# EAGLE board fc (EAGLE 5.10)
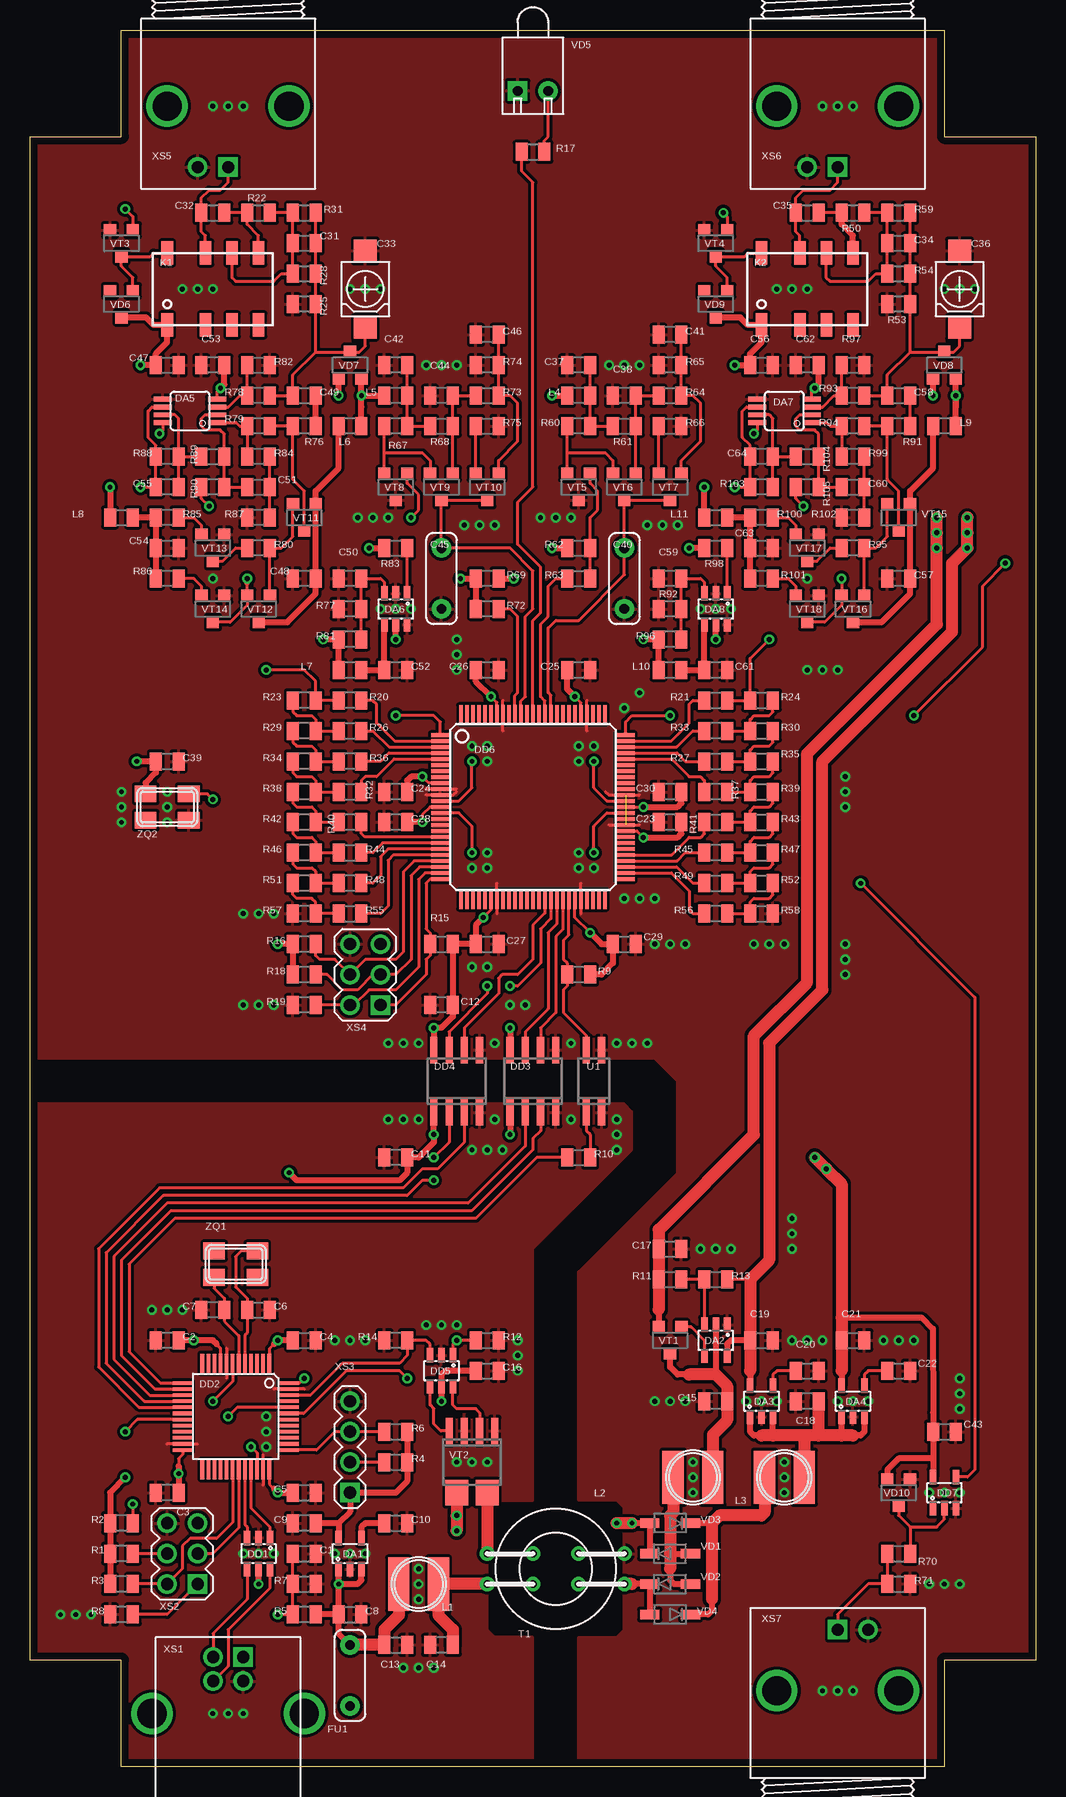
[diagram p4: board, top side]
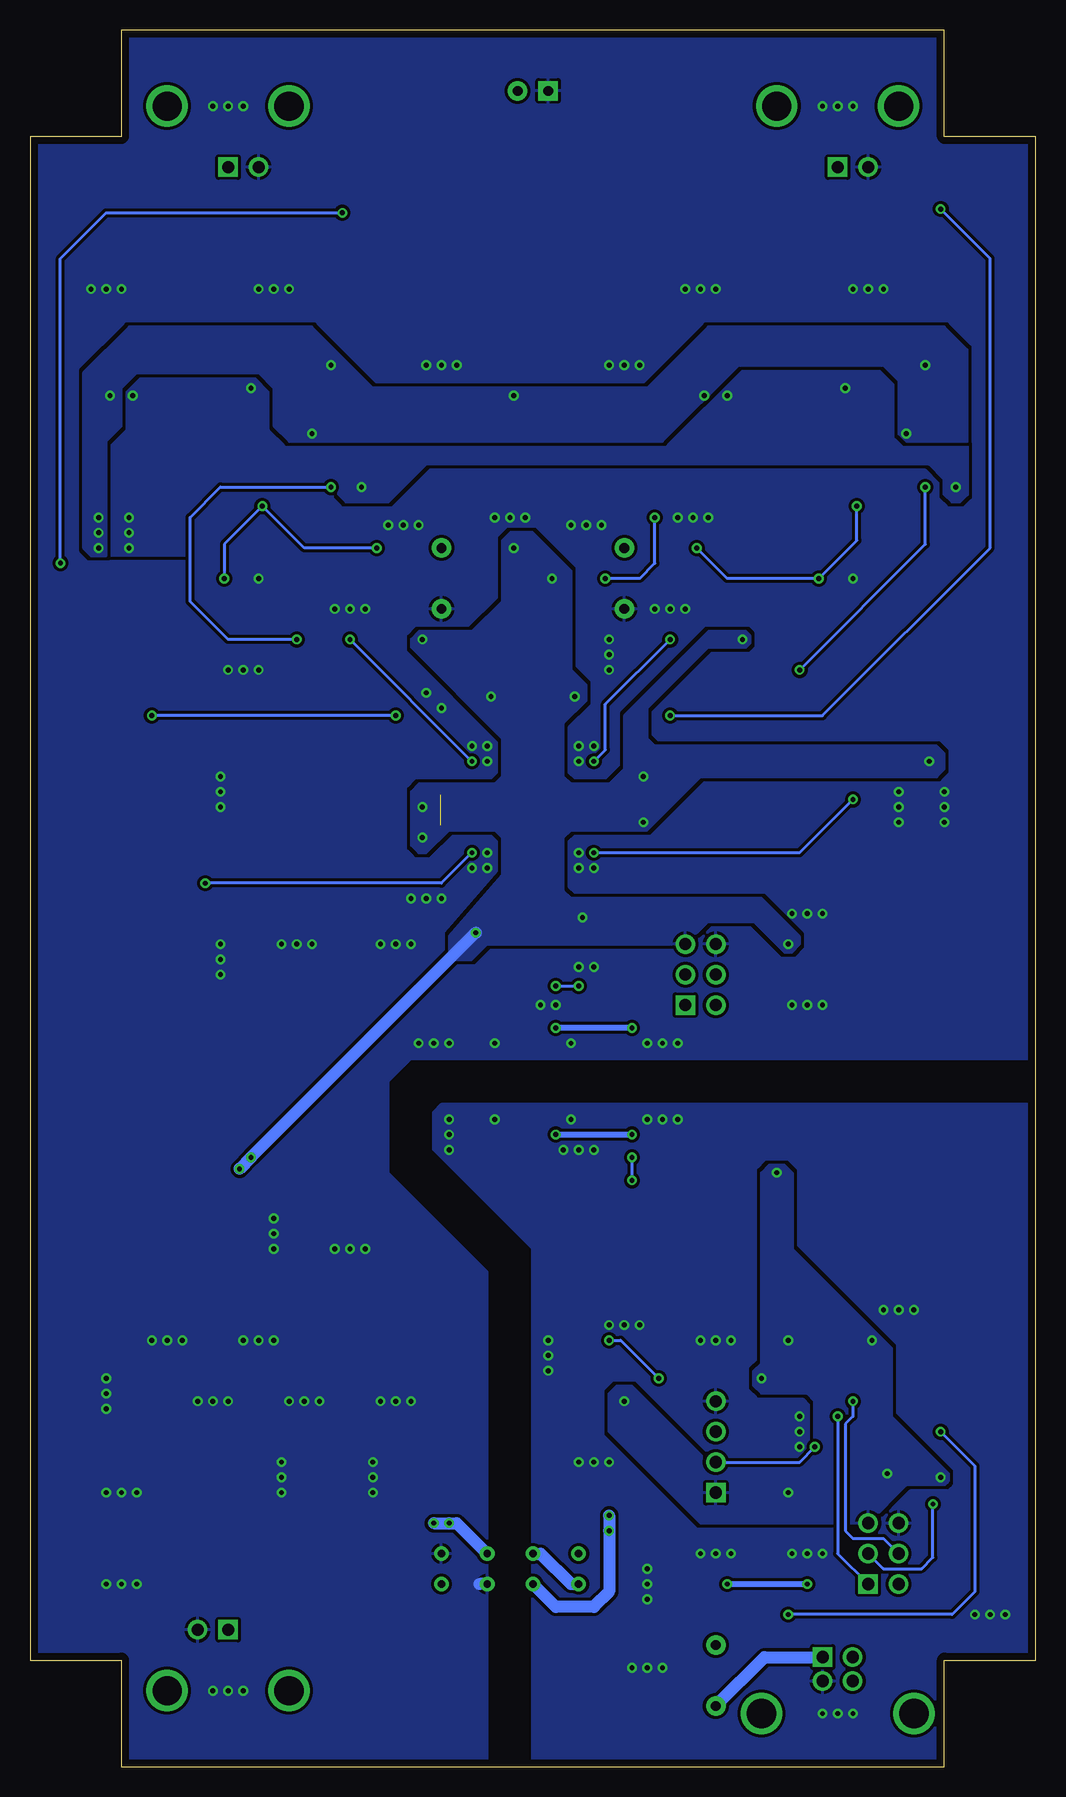
[diagram p5: board, bottom side, seen from below]

Size 83.82 x 144.78 mm. Coordinates in mm from the lower left corner, seen from the top.
Outline: 83.82,8.89 76.2,8.89 76.2,0 7.62,0 7.62,8.89 0,8.89 0,135.89 7.62,135.89 7.62,144.78 76.2,144.78 76.2,135.89 83.82,135.89 83.82,8.89
Copper layers (1*16): Top 0.035mm / dielectric 1.5mm / Bottom 0.035mm
Design rules "kovar *": minimum track width 10mil, minimum drill 16mil, track to track 6mil, track to pad 6mil, pad to pad 6mil, via to via 6mil, smd to smd 6mil, copper to edge 25mil, drill to drill 25mil, minimum pad ring 10mil, minimum via ring 8mil, stop-mask expansion 4mil, vias tented up to drill 32mil, thermal gap 10mil

## Footprints (pad centres in the part's own frame; a part is rotated, then mirrored left to right if it is on the bottom)
GENERIC/0805 = smd 1 x 1.5: 1 -0.95,0; 2 0.95,0
CAPACITOR/TRIM/TZBX4 = smd 1.905 x 1.905: 1 -3.175,0; 2 3.175,0
CAPACITOR/3 = drill 0.813 pad 1.626 round: 1 -2.54,0; 2 2.54,0
GENERIC/SOT23-5 = smd 0.55 x 1.2: 1 -0.95,-1.3; 2 0,-1.3; 3 0.95,-1.3; 4 0.95,1.3; 5 -0.95,1.3
MSOP08 = smd 0.4 x 1.5: 1 -0.976,-2.263; 2 -0.326,-2.263; 3 0.324,-2.263; 4 0.974,-2.263; 5 0.974,2.262; 6 0.324,2.262; 7 -0.326,2.262; 8 -0.976,2.262
GENERIC/SOT23-6 = smd 0.55 x 1.2: 1 -0.95,-1.3; 2 0,-1.3; 3 0.95,-1.3; 4 0.95,1.3; 5 0,1.3; 6 -0.95,1.3
LQFP48 = smd 1.6 x 0.3: 1 -4.431,2.794; 2 -4.431,2.286; 3 -4.431,1.778; 4 -4.431,1.27; 5 -4.431,0.762; 6 -4.431,0.254; 7 -4.431,-0.254; 8 -4.431,-0.762; 9 -4.431,-1.27; 10 -4.431,-1.778; 11 -4.431,-2.286; 12 -4.431,-2.794; 25 4.431,-2.794; 26 4.431,-2.286; 27 4.431,-1.778; 28 4.431,-1.27; 29 4.431,-0.762; 30 4.431,-0.254; 31 4.431,0.254; 32 4.431,0.762; 33 4.431,1.27; 34 4.431,1.778; 35 4.431,2.286; 36 4.431,2.794 | smd 0.3 x 1.6: 13 -2.794,-4.431; 14 -2.286,-4.431; 15 -1.778,-4.431; 16 -1.27,-4.431; 17 -0.762,-4.431; 18 -0.254,-4.431; 19 0.254,-4.431; 20 0.762,-4.431; 21 1.27,-4.431; 22 1.778,-4.431; 23 2.286,-4.431; 24 2.794,-4.431; 37 2.794,4.431; 38 2.286,4.431; 39 1.778,4.431; 40 1.27,4.431; 41 0.762,4.431; 42 0.254,4.431; 43 -0.254,4.431; 44 -0.762,4.431; 45 -1.27,4.431; 46 -1.778,4.431; 47 -2.286,4.431; 48 -2.794,4.431
SO08 = smd 0.6 x 2.2: 1 -1.905,-2.6; 2 -0.635,-2.6; 3 0.635,-2.6; 4 1.905,-2.6; 5 1.905,2.6; 6 0.635,2.6; 7 -0.635,2.6; 8 -1.905,2.6
LQFP100 = smd 1.524 x 0.305: 1 -7.72,6; 2 -7.72,5.5; 3 -7.72,5; 4 -7.72,4.5; 5 -7.72,4; 6 -7.72,3.5; 7 -7.72,3; 8 -7.72,2.5; 9 -7.72,2; 10 -7.72,1.5; 11 -7.72,1; 12 -7.72,0.5; 13 -7.72,0; 14 -7.72,-0.5; 15 -7.72,-1; 16 -7.72,-1.5; 17 -7.72,-2; 18 -7.72,-2.5; 19 -7.72,-3; 20 -7.72,-3.5; 21 -7.72,-4; 22 -7.72,-4.5; 23 -7.72,-5; 24 -7.72,-5.5; 25 -7.72,-6; 51 7.72,-6; 52 7.72,-5.5; 53 7.72,-5; 54 7.72,-4.5; 55 7.72,-4; 56 7.72,-3.5; 57 7.72,-3; 58 7.72,-2.5; 59 7.72,-2; 60 7.72,-1.5; 61 7.72,-1; 62 7.72,-0.5; 63 7.72,0; 64 7.72,0.5; 65 7.72,1; 66 7.72,1.5; 67 7.72,2; 68 7.72,2.5; 69 7.72,3; 70 7.72,3.5; 71 7.72,4; 72 7.72,4.5; 73 7.72,5; 74 7.72,5.5; 75 7.72,6 | smd 0.305 x 1.524: 26 -6,-7.72; 27 -5.5,-7.72; 28 -5,-7.72; 29 -4.5,-7.72; 30 -4,-7.72; 31 -3.5,-7.72; 32 -3,-7.72; 33 -2.5,-7.72; 34 -2,-7.72; 35 -1.5,-7.72; 36 -1,-7.72; 37 -0.5,-7.72; 38 0,-7.72; 39 0.5,-7.72; 40 1,-7.72; 41 1.5,-7.72; 42 2,-7.72; 43 2.5,-7.72; 44 3,-7.72; 45 3.5,-7.72; 46 4,-7.72; 47 4.5,-7.72; 48 5,-7.72; 49 5.5,-7.72; 50 6,-7.72; 76 6,7.72; 77 5.5,7.72; 78 5,7.72; 79 4.5,7.72; 80 4,7.72; 81 3.5,7.72; 82 3,7.72; 83 2.5,7.72; 84 2,7.72; 85 1.5,7.72; 86 1,7.72; 87 0.5,7.72; 88 0,7.72; 89 -0.5,7.72; 90 -1,7.72; 91 -1.5,7.72; 92 -2,7.72; 93 -2.5,7.72; 94 -3,7.72; 95 -3.5,7.72; 96 -4,7.72; 97 -4.5,7.72; 98 -5,7.72; 99 -5.5,7.72; 100 -6,7.72
RELAY/2/6/IM = smd 0.965 x 1.93: 1 -3.8,-3; 2 -0.6,-3; 3 1.6,-3; 4 3.8,-3; 5 3.8,3; 6 1.6,3; 7 -0.6,3; 8 -3.8,3
INDUCTOR/SDR0403 = smd 1.778 x 4.445: 1 -1.651,0; 2 1.651,0
TRANSFORMER/B64290L = drill 0.61 pad 1.219 round: 1 -5.715,1.27; 2 -1.905,1.27; 3 -5.715,-1.27; 4 -1.905,-1.27; 5 1.905,1.27; 6 5.715,1.27; 7 1.905,-1.27; 8 5.715,-1.27
SO04 = smd 0.6 x 2.2: 1 -0.635,-2.6; 2 0.635,-2.6; 3 0.635,2.6; 4 -0.635,2.6
GENERIC/SOD123 = smd 1.6 x 0.8: A 1.7,0; C -1.7,0
LED/3/R = drill 0.813 pad 1.626 round: A -1.27,0 | drill 0.813 pad 1.626 square: K 1.27,0
GENERIC/SOT23 = smd 1.016 x 1.016: 1 -0.95,-1.1; 2 0.95,-1.1; 3 0,1.1
SO08/6 = smd 0.6 x 2.2: 1 -1.905,-2.6; 2 -0.635,-2.6; 3 0.635,-2.6; 4 1.905,-2.6 | smd 1.905 x 2.159: 5,6 1.27,2.54; 7,8 -1.27,2.54
CONNECTOR/4/USBB-F = drill 1.016 pad 1.626 square: 1 1.25,4.075 | drill 1.016 pad 1.626 round: 2 -1.25,4.075; 3 -1.25,2.075; 4 1.25,2.075 | drill 2.438 pad 3.251 round: P$1 6.35,-0.635; P$2 -6.35,-0.635
CONNECTOR:6:PLD = drill 1.016 pad 1.626 square: 1 -2.54,-1.27 | drill 1.016 pad 1.626 round: 2 -2.54,1.27; 3 0,-1.27; 4 0,1.27; 5 2.54,-1.27; 6 2.54,1.27
CONNECTOR/4/PLS = drill 1.016 pad 1.626 square: 1 -3.81,0 | drill 1.016 pad 1.626 round: 2 -1.27,0; 3 1.27,0; 4 3.81,0
CONNECTOR/6/PLD = drill 1.016 pad 1.626 square: 1 -2.54,-1.27 | drill 1.016 pad 1.626 round: 2 -2.54,1.27; 3 0,-1.27; 4 0,1.27; 5 2.54,-1.27; 6 2.54,1.27
CONNECTOR/2/BNC = drill 1.016 pad 1.626 square: 1 0,-5.08 | drill 1.016 pad 1.626 round: 2 -2.54,-5.08 | drill 2.438 pad 3.251 round: P1 -5.08,0; P2 5.08,0
QUARTZ/KX-9A = smd 1.8 x 1.4: 1 -1.8,-1.1; 2 1.8,-1.1; 3 1.8,1.1; 4 -1.8,1.1

## Placement (x,y rotation side)
C1  u10  [GENERIC/0805]  22.86,17.78 0 top
C2  u10  [GENERIC/0805]  11.43,35.56 180 top
C3  u10  [GENERIC/0805]  11.43,22.86 180 top
C4  u10  [GENERIC/0805]  22.86,35.56 0 top
C5  u10  [GENERIC/0805]  22.86,22.86 0 top
C6  22p  [GENERIC/0805]  19.05,38.1 0 top
C7  22p  [GENERIC/0805]  15.24,38.1 180 top
C8  u10  [GENERIC/0805]  26.67,12.7 0 top
C9  10u  [GENERIC/0805]  22.86,20.32 180 top
C10  1n0  [GENERIC/0805]  30.48,20.32 0 top
C11  u10  [GENERIC/0805]  30.48,50.8 180 top
C12  u10  [GENERIC/0805]  34.29,63.5 180 top
C13  10u  [GENERIC/0805]  30.48,10.16 0 top
C14  10u  [GENERIC/0805]  34.29,10.16 180 top
C15  10u  [GENERIC/0805]  57.15,30.48 180 top
C16  u10  [GENERIC/0805]  38.1,33.02 0 top
C17  10u  [GENERIC/0805]  53.34,43.18 0 top
C18  10u  [GENERIC/0805]  64.77,30.48 180 top
C19  10u  [GENERIC/0805]  60.96,35.56 0 top
C20  1n0  [GENERIC/0805]  64.77,33.02 0 top
C21  10u  [GENERIC/0805]  68.58,35.56 0 top
C22  1n0  [GENERIC/0805]  72.39,33.02 0 top
C23  u10  [GENERIC/0805]  53.34,78.74 180 top
C24  u10  [GENERIC/0805]  30.48,81.28 180 top
C25  u10  [GENERIC/0805]  45.72,91.44 0 top
C26  u10  [GENERIC/0805]  38.1,91.44 0 top
C27  u10  [GENERIC/0805]  38.1,68.58 0 top
C28  u10  [GENERIC/0805]  30.48,78.74 180 top
C29  u10  [GENERIC/0805]  49.53,68.58 0 top
C30  u10  [GENERIC/0805]  53.34,81.28 180 top
C31  18pF*  [GENERIC/0805]  22.86,127 0 top
C32  68n  [GENERIC/0805]  15.24,129.54 0 top
C33  TZBX4  [CAPACITOR/TRIM/TZBX4]  27.94,123.19 90 top
C34  18pF*  [GENERIC/0805]  72.39,127 0 top
C35  68n  [GENERIC/0805]  64.77,129.54 0 top
C36  TZBX4  [CAPACITOR/TRIM/TZBX4]  77.47,123.19 90 top
C37  u10  [GENERIC/0805]  45.72,116.84 180 top
C38  u10  [GENERIC/0805]  49.53,114.3 180 top
C39  u10  [GENERIC/0805]  11.43,83.82 0 top
C40  1n0  [CAPACITOR/3]  49.53,99.06 270 top
C41  u10  [GENERIC/0805]  53.34,119.38 180 top
C42  u10  [GENERIC/0805]  30.48,116.84 180 top
C43  u10  [GENERIC/0805]  76.2,27.94 0 top
C44  u10  [GENERIC/0805]  34.29,114.3 180 top
C45  1n0  [CAPACITOR/3]  34.29,99.06 270 top
C46  u10  [GENERIC/0805]  38.1,119.38 180 top
C47  u10  [GENERIC/0805]  11.43,116.84 0 top
C48  u10  [GENERIC/0805]  22.86,99.06 180 top
C49  n47  [GENERIC/0805]  22.86,114.3 0 top
C50  u10  [GENERIC/0805]  26.67,99.06 180 top
C51  47n  [GENERIC/0805]  19.05,106.68 0 top
C52  u10  [GENERIC/0805]  30.48,91.44 0 top
C53  u10  [GENERIC/0805]  15.24,116.84 180 top
C54  u10  [GENERIC/0805]  11.43,101.6 0 top
C55  1n0  [GENERIC/0805]  11.43,106.68 180 top
C56  u10  [GENERIC/0805]  60.96,116.84 0 top
C57  u10  [GENERIC/0805]  72.39,99.06 180 top
C58  n47  [GENERIC/0805]  72.39,114.3 0 top
C59  u10  [GENERIC/0805]  53.34,99.06 180 top
C60  47n  [GENERIC/0805]  68.58,106.68 0 top
C61  u10  [GENERIC/0805]  57.15,91.44 0 top
C62  u10  [GENERIC/0805]  64.77,116.84 180 top
C63  u10  [GENERIC/0805]  60.96,101.6 0 top
C64  1n0  [GENERIC/0805]  60.96,109.22 180 top
DA1  TPS76333DBVR  [GENERIC/SOT23-5]  26.67,17.78 0 top
DA2  LM321  [GENERIC/SOT23-5]  57.15,35.56 180 top
DA3  TPS76350DBVR  [GENERIC/SOT23-5]  60.96,30.48 0 top
DA4  TPS76333DBVR  [GENERIC/SOT23-5]  68.58,30.48 0 top
DA5  TLV272IDGK  [MSOP08]  13.33,113.03 90 top
DA6  TLV3501AIDBVR  [GENERIC/SOT23-6]  30.48,96.52 180 top
DA7  TLV272IDGK  [MSOP08]  62.86,113.03 90 top
DA8  TLV3501AIDBVR  [GENERIC/SOT23-6]  57.15,96.52 180 top
DD1  USBLC6-2SC6  [GENERIC/SOT23-6]  19.05,17.78 180 top
DD2  STM32F042C6T  [LQFP48]  17.14,29.21 270 top
DD3  ISO7420DR  [SO08]  41.91,57.15 0 top
DD4  ISO7421DR  [SO08]  35.56,57.15 0 top
DD5  74LVC2G17  [GENERIC/SOT23-6]  34.29,33.02 180 top
DD6  EPM240T100C5  [LQFP100]  41.91,80.01 0 top
DD7  74LVC1G17  [GENERIC/SOT23-5]  76.2,22.86 0 top
FU1  MF-R110  [CAPACITOR/3]  26.67,7.62 270 top
K1  IM23GR  [RELAY/2/6/IM]  15.24,123.19 0 top
K2  IM23GR  [RELAY/2/6/IM]  64.77,123.19 0 top
L1  SDR0403-220  [INDUCTOR/SDR0403]  32.38,15.24 0 top
L2  SDR0403-560  [INDUCTOR/SDR0403]  55.24,24.13 0 top
L3  SDR0403-560  [INDUCTOR/SDR0403]  62.86,24.13 0 top
L4  BLM21  [GENERIC/0805]  45.72,114.3 180 top
L5  BLM21  [GENERIC/0805]  30.48,114.3 180 top
L6  BLM21  [GENERIC/0805]  26.67,111.76 180 top
L7  BLM21  [GENERIC/0805]  26.67,91.44 0 top
L8  BLM21  [GENERIC/0805]  7.62,104.14 0 top
L9  BLM21  [GENERIC/0805]  76.2,111.76 180 top
L10  BLM21  [GENERIC/0805]  53.34,91.44 0 top
L11  BLM21  [GENERIC/0805]  57.15,104.14 0 top
R1  10K  [GENERIC/0805]  7.62,17.78 180 top
R2  10K  [GENERIC/0805]  7.62,20.32 180 top
R3  10K  [GENERIC/0805]  7.62,15.24 180 top
R4  10K  [GENERIC/0805]  30.48,25.4 0 top
R5  M10  [GENERIC/0805]  22.86,12.7 180 top
R6  10K  [GENERIC/0805]  30.48,27.94 0 top
R7  M10  [GENERIC/0805]  22.86,15.24 0 top
R8  10K  [GENERIC/0805]  7.62,12.7 180 top
R9  10K  [GENERIC/0805]  45.72,66.04 180 top
R10  2K0  [GENERIC/0805]  45.72,50.8 0 top
R11  10K  [GENERIC/0805]  53.34,40.64 0 top
R12  M10  [GENERIC/0805]  38.1,35.56 0 top
R13  20K  [GENERIC/0805]  57.15,40.64 0 top
R14  M10  [GENERIC/0805]  30.48,35.56 180 top
R15  10K  [GENERIC/0805]  34.29,68.58 0 top
R16  10K  [GENERIC/0805]  22.86,68.58 180 top
R17  2K0  [GENERIC/0805]  41.91,134.62 0 top
R18  10K  [GENERIC/0805]  22.86,66.04 180 top
R19  10K  [GENERIC/0805]  22.86,63.5 180 top
R20  20K0  [GENERIC/0805]  26.67,88.9 180 top
R21  20K0  [GENERIC/0805]  57.15,88.9 0 top
R22  1M0  [GENERIC/0805]  19.05,129.54 0 top
R23  10K0  [GENERIC/0805]  22.86,88.9 180 top
R24  10K0  [GENERIC/0805]  60.96,88.9 0 top
R25  1M0  [GENERIC/0805]  22.86,121.92 180 top
R26  20K0  [GENERIC/0805]  26.67,86.36 0 top
R27  20K0  [GENERIC/0805]  57.15,86.36 180 top
R28  1M0  [GENERIC/0805]  22.86,124.46 0 top
R29  10K0  [GENERIC/0805]  22.86,86.36 180 top
R30  10K0  [GENERIC/0805]  60.96,86.36 0 top
R31  1M0  [GENERIC/0805]  22.86,129.54 0 top
R32  20K0  [GENERIC/0805]  26.67,83.82 180 top
R33  20K0  [GENERIC/0805]  57.15,83.82 0 top
R34  10K0  [GENERIC/0805]  22.86,83.82 180 top
R35  10K0  [GENERIC/0805]  60.96,83.82 0 top
R36  20K0  [GENERIC/0805]  26.67,81.28 0 top
R37  20K0  [GENERIC/0805]  57.15,81.28 180 top
R38  10K0  [GENERIC/0805]  22.86,81.28 180 top
R39  10K0  [GENERIC/0805]  60.96,81.28 0 top
R40  20K0  [GENERIC/0805]  26.67,78.74 180 top
R41  20K0  [GENERIC/0805]  57.15,78.74 0 top
R42  10K0  [GENERIC/0805]  22.86,78.74 180 top
R43  10K0  [GENERIC/0805]  60.96,78.74 0 top
R44  20K0  [GENERIC/0805]  26.67,76.2 0 top
R45  20K0  [GENERIC/0805]  57.15,76.2 180 top
R46  10K0  [GENERIC/0805]  22.86,76.2 180 top
R47  10K0  [GENERIC/0805]  60.96,76.2 0 top
R48  20K0  [GENERIC/0805]  26.67,73.66 180 top
R49  20K0  [GENERIC/0805]  57.15,73.66 0 top
R50  1M0  [GENERIC/0805]  68.58,129.54 0 top
R51  10K0  [GENERIC/0805]  22.86,73.66 180 top
R52  10K0  [GENERIC/0805]  60.96,73.66 0 top
R53  1M0  [GENERIC/0805]  72.39,121.92 180 top
R54  1M0  [GENERIC/0805]  72.39,124.46 0 top
R55  20K0  [GENERIC/0805]  26.67,71.12 0 top
R56  20K0  [GENERIC/0805]  57.15,71.12 180 top
R57  20K0  [GENERIC/0805]  22.86,71.12 180 top
R58  20K0  [GENERIC/0805]  60.96,71.12 0 top
R59  1M0  [GENERIC/0805]  72.39,129.54 0 top
R60  K12  [GENERIC/0805]  45.72,111.76 180 top
R61  K56  [GENERIC/0805]  49.53,111.76 0 top
R62  82R  [GENERIC/0805]  45.72,101.6 0 top
R63  K36  [GENERIC/0805]  45.72,99.06 0 top
R64  K36  [GENERIC/0805]  53.34,114.3 0 top
R65  K47  [GENERIC/0805]  53.34,116.84 180 top
R66  10K  [GENERIC/0805]  53.34,111.76 0 top
R67  K12  [GENERIC/0805]  30.48,111.76 180 top
R68  K56  [GENERIC/0805]  34.29,111.76 0 top
R69  82R  [GENERIC/0805]  38.1,99.06 180 top
R70  51R  [GENERIC/0805]  72.39,17.78 0 top
R71  10K  [GENERIC/0805]  72.39,15.24 0 top
R72  K36  [GENERIC/0805]  38.1,96.52 180 top
R73  K36  [GENERIC/0805]  38.1,114.3 0 top
R74  K47  [GENERIC/0805]  38.1,116.84 180 top
R75  10K  [GENERIC/0805]  38.1,111.76 0 top
R76  51R  [GENERIC/0805]  22.86,111.76 180 top
R77  K75  [GENERIC/0805]  26.67,96.52 180 top
R78  M82  [GENERIC/0805]  19.05,114.3 180 top
R79  1M0  [GENERIC/0805]  19.05,111.76 180 top
R80  51R  [GENERIC/0805]  19.05,101.6 180 top
R81  K24  [GENERIC/0805]  26.67,93.98 180 top
R82  M18  [GENERIC/0805]  19.05,116.84 0 top
R83  51R  [GENERIC/0805]  30.48,101.6 0 top
R84  8K2  [GENERIC/0805]  19.05,109.22 180 top
R85  K43  [GENERIC/0805]  11.43,104.14 180 top
R86  K43  [GENERIC/0805]  11.43,99.06 180 top
R87  1K8  [GENERIC/0805]  19.05,104.14 180 top
R88  3K3  [GENERIC/0805]  11.43,109.22 180 top
R89  18K  [GENERIC/0805]  15.24,109.22 0 top
R90  82K  [GENERIC/0805]  15.24,106.68 180 top
R91  51R  [GENERIC/0805]  72.39,111.76 180 top
R92  K75  [GENERIC/0805]  53.34,96.52 180 top
R93  M82  [GENERIC/0805]  68.58,114.3 180 top
R94  1M0  [GENERIC/0805]  68.58,111.76 180 top
R95  51R  [GENERIC/0805]  68.58,101.6 180 top
R96  K24  [GENERIC/0805]  53.34,93.98 180 top
R97  M18  [GENERIC/0805]  68.58,116.84 0 top
R98  51R  [GENERIC/0805]  57.15,101.6 0 top
R99  8K2  [GENERIC/0805]  68.58,109.22 180 top
R100  K43  [GENERIC/0805]  60.96,104.14 180 top
R101  K43  [GENERIC/0805]  60.96,99.06 180 top
R102  1K8  [GENERIC/0805]  68.58,104.14 180 top
R103  3K3  [GENERIC/0805]  60.96,106.68 180 top
R104  18K  [GENERIC/0805]  64.77,109.22 0 top
R105  82K  [GENERIC/0805]  64.77,106.68 180 top
T1  B64290L087  [TRANSFORMER/B64290L]  43.81,16.51 0 top
U1  TLP291  [SO04]  46.99,57.15 0 top
VD1  MBR0520  [GENERIC/SOD123]  53.34,17.78 0 top
VD2  MBR0520  [GENERIC/SOD123]  53.34,15.24 0 top
VD3  MBR0520  [GENERIC/SOD123]  53.34,20.32 180 top
VD4  MBR0520  [GENERIC/SOD123]  53.34,12.7 180 top
VD5  L-934EW/1GD  [LED/3/R]  41.91,139.7 180 top
VD6  BAT54  [GENERIC/SOT23]  7.62,121.92 180 top
VD7  BAV199  [GENERIC/SOT23]  26.67,116.84 0 top
VD8  BAV199  [GENERIC/SOT23]  76.2,116.84 0 top
VD9  BAT54  [GENERIC/SOT23]  57.15,121.92 180 top
VD10  BAV199  [GENERIC/SOT23]  72.39,22.86 180 top
VT1  MMBT4403  [GENERIC/SOT23]  53.34,35.56 180 top
VT2  IRF7311  [SO08/6]  36.83,25.4 180 top
VT3  BCR108  [GENERIC/SOT23]  7.62,127 180 top
VT4  BCR108  [GENERIC/SOT23]  57.15,127 180 top
VT5  BFT93  [GENERIC/SOT23]  45.72,106.68 180 top
VT6  BFT93  [GENERIC/SOT23]  49.53,106.68 180 top
VT7  BFR93  [GENERIC/SOT23]  53.34,106.68 180 top
VT8  BFT93  [GENERIC/SOT23]  30.48,106.68 180 top
VT9  BFT93  [GENERIC/SOT23]  34.29,106.68 180 top
VT10  BFR93  [GENERIC/SOT23]  38.1,106.68 180 top
VT11  MMBFJ309  [GENERIC/SOT23]  22.86,104.14 180 top
VT12  BFR93  [GENERIC/SOT23]  19.05,96.52 180 top
VT13  BFR93  [GENERIC/SOT23]  15.24,101.6 180 top
VT14  BFR93  [GENERIC/SOT23]  15.24,96.52 180 top
VT15  MMBFJ309  [GENERIC/SOT23]  72.39,104.14 180 top
VT16  BFR93  [GENERIC/SOT23]  68.58,96.52 180 top
VT17  BFR93  [GENERIC/SOT23]  64.77,101.6 180 top
VT18  BFR93  [GENERIC/SOT23]  64.77,96.52 180 top
XS1  USBB-1J  [CONNECTOR/4/USBB-F]  16.51,5.08 0 top
XS2  PLD-6  [CONNECTOR:6:PLD]  12.7,17.78 90 top
XS3  PLS-4  [CONNECTOR/4/PLS]  26.67,26.67 90 top
XS4  PLD-6  [CONNECTOR/6/PLD]  27.94,66.04 90 top
XS5  BNC-JR  [CONNECTOR/2/BNC]  16.51,138.43 0 top
XS6  BNC-JR  [CONNECTOR/2/BNC]  67.31,138.43 0 top
XS7  BNC-JR  [CONNECTOR/2/BNC]  67.31,6.35 180 top
ZQ1  KX-9A 8.0MHz  [QUARTZ/KX-9A]  17.14,41.91 180 top
ZQ2  FOX924B-25.000  [QUARTZ/KX-9A]  11.43,80.01 0 top

## Tracks (layer width: path | path; a pad name or v marks a point on that pad's centre or on a via)
0V  (via drill 0.41 pad 0.81)
  Top 0.254: 13.97,26.92 DD2.23 11.43,26.92 | 19.43,23.49 DD2.35 19.43,26.04 | 22.86,31.5 DD2.47 20.32,31.5 | 16.38,34.92 DD2.8 16.38,32.38
  other vias: 38.73,53.98 45.08,53.98 48.89,53.98 32.38,53.98 5.08,12.7 3.81,12.7 2.54,12.7 12.7,38.1 11.43,38.1 10.16,38.1 25.4,35.56 26.67,35.56 27.94,35.56 35.56,25.4 36.83,25.4 38.1,25.4 32.38,16.51 32.38,15.24 32.38,13.97 31.11,8.25 32.38,8.25 33.65,8.25 31.11,53.98 29.84,53.98 48.89,52.7 48.89,51.44 38.1,51.44 36.83,51.44 39.37,51.44 17.78,17.78 19.05,17.78 20.32,17.78 25.4,17.78 26.67,17.78 27.94,17.78 16.51,4.45 15.24,4.45 17.78,4.45 19.68,29.21 19.68,27.94 19.68,26.67 40.64,33.02 40.64,34.29 40.64,35.56 34.29,36.83 35.56,36.83 33.02,36.83
  pour Bottom (isolate 0.254, rank 6): 0,8.89 7.62,8.89 7.62,0 41.91,0 41.91,43.18 50.16,51.44 50.16,54.61 49.53,55.25 0,55.25
  pour Top (isolate 0.254, rank 6): 0,8.89 7.62,8.89 7.62,0 41.91,0 41.91,10.8 38.73,10.8 38.1,11.43 38.1,21.59 38.73,22.23 41.91,22.23 41.91,43.18 50.16,51.44 50.16,54.61 49.53,55.25 0,55.25
0VA  (via drill 0.41 pad 0.81)  (1 unrouted)
  Top 0.254: 50.8,81.01 DD6.65 48.21,81.01 47.94,81.28 | 50.8,78.51 DD6.60 48.26,78.51 | 39.41,86.36 DD6.93 39.41,88.9 | 46.41,86.36 DD6.79 46.41,88.9 | 38.91,73.66 DD6.32 38.91,71.12 | 45.91,73.66 DD6.46 45.91,71.12 | 35.56,81.51 DD6.10 33.02,81.51 | 33.02,81.01 DD6.11 35.29,81.01 35.56,81.28
  Bottom 1.016: T1.7 46.35,15.24
  other vias: 38.73,60.33 45.08,60.33 48.89,60.33 32.38,60.33 55.24,25.4 55.24,24.13 55.24,22.86 62.86,25.4 62.86,24.13 62.86,22.86 59.69,30.48 60.96,30.48 62.23,30.48 67.31,30.48 68.58,30.48 69.85,30.48 71.12,35.56 72.39,35.56 63.5,35.56 64.77,35.56 66.04,35.56 73.66,35.56 55.88,43.18 57.15,43.18 58.42,43.18 54.61,30.48 53.34,30.48 52.07,30.48 77.47,29.84 77.47,31.12 77.47,32.38 50.16,60.33 51.43,60.33 31.11,60.33 29.84,60.33 40,63.5 41.27,63.5 20.32,63.5 19.05,63.5 17.78,63.5 20.32,71.12 19.05,71.12 17.78,71.12 7.62,80.01 7.62,81.28 7.62,78.74 38.1,74.93 36.83,74.93 38.1,76.2 49.53,72.39 50.8,72.39 52.07,72.39 52.07,68.58 53.34,68.58 54.61,68.58 49.53,88.27 50.8,89.53 35.56,91.44 35.56,92.71 35.56,93.98 36.19,103.5 37.46,103.5 38.73,103.5 51.43,103.5 52.7,103.5 53.97,103.5 42.54,104.14 43.81,104.14 45.08,104.14 29.84,104.14 28.57,104.14 27.3,104.14 33.02,116.84 34.29,116.84 35.56,116.84 48.26,116.84 49.53,116.84 50.8,116.84 64.77,123.19 63.5,123.19 62.23,123.19 15.24,123.19 13.97,123.19 12.7,123.19 29.21,123.19 27.94,123.19 26.67,123.19 77.47,123.19 76.2,123.19 78.74,123.19 15.24,99.06 29.21,96.52 30.48,96.52 31.75,96.52 55.88,96.52 57.15,96.52 58.42,96.52 64.77,99.06 38.1,83.82 38.1,85.09 36.83,85.09 45.72,76.2 45.72,74.93 46.99,74.93 46.99,85.09 45.72,85.09 45.72,83.82 38.1,66.67 36.83,66.67 11.43,81.28 11.43,80.01 11.43,78.74 67.31,91.44 64.77,91.44 66.04,91.44 67.94,82.55 67.94,81.28 67.94,80.01 62.86,68.58 61.59,68.58 60.32,68.58 67.94,67.31 67.94,68.58 67.94,66.04 63.5,43.18 63.5,44.45 63.5,45.72 74.93,15.24 76.2,15.24 77.47,15.24 74.93,22.86 76.2,22.86 77.47,22.86 15.24,138.43 16.51,138.43 17.78,138.43 66.04,138.43 67.31,138.43 68.58,138.43 66.04,6.35 67.31,6.35 68.58,6.35
  pour Top (isolate 0.254, rank 6): 0,135.89 7.62,135.89 7.62,144.78 76.2,144.78 76.2,135.89 83.82,135.89 83.82,8.89 76.2,8.89 76.2,0 45.72,0 45.72,10.8 48.89,10.8 49.53,11.43 49.53,21.59 48.89,22.23 45.72,22.23 45.72,41.28 53.97,49.53 53.97,57.15 52.07,59.05 0,59.05
  pour Bottom (isolate 0.254, rank 6): 7.62,144.78 76.2,144.78 76.2,135.89 83.82,135.89 83.82,8.89 76.2,8.89 76.2,0 45.72,0 45.72,41.28 53.97,49.53 53.97,57.15 52.07,59.05 0,59.05 0,135.89 7.62,135.89
CH1_CLK  (via drill 0.41 pad 0.81)
  Top 0.254: DD6.12 35.74,80.51 36.83,81.6 v36.83,83.82
  Top 0.508: v30.48,93.98 DA6.5
  Bottom 0.254: v30.48,93.98 35.88,88.58 35.88,84.77 v36.83,83.82
CH1_DAC  (via drill 0.41 pad 0.81)
  Top 0.254: R20.2 R23.1 23.81,90.49 22.86,91.44 v19.68,91.44 | DA5.6 10.17,113.35 9.84,113.03 9.84,110.81 10.48,110.17 R88.2 C55.2 v9.21,106.68
  Bottom 0.254: v19.68,91.44 9.21,101.92 v9.21,106.68
CH1_DAC0
  Top 0.254: R55.2 29.21,71.12 29.84,71.75 29.84,75.56 30.29,76.01 DD6.21
CH1_DAC1
  Top 0.254: DD6.20 29.84,76.51 29.21,75.88 29.21,74.3 28.57,73.66 R48.1
CH1_DAC2
  Top 0.254: DD6.19 29.38,77.01 28.57,76.2 R44.2
CH1_DAC3
  Top 0.254: DD6.18 27.9,77.51 27.62,77.79 R40.1
CH1_DAC4
  Top 0.254: R36.2 27.62,82.23 27.94,82.55 28.89,82.55 30.35,84.01 DD6.5
CH1_DAC5
  Top 0.254: DD6.4 29.9,84.51 29.21,83.82 R32.1
CH1_DAC6
  Top 0.254: R26.2 28.57,86.36 29.92,85.01 DD6.3
CH1_DAC7
  Top 0.254: DD6.2 30.38,85.51 28.89,87 28.89,88.58 28.57,88.9 R20.1
CH1_HPF  (via drill 0.41 pad 0.81)
  Top 0.254: DD6.1 34.19,87.09 33.65,87.63 v30.48,87.63 | VT3.1 8.57,129.22 v7.94,129.86
  Bottom 0.254: v30.48,87.63 17.78,87.63 3.81,101.6 3.81,125.73 v7.94,129.86
CH1_LNA
  Top 0.254: R31.2 C31.2 R28.2 R25.1 23.81,117.94 | R78.1 C49.1 21.91,116.04 23.81,117.94 | 23.81,117.94 VD7.3 27.45,117.94 27.94,118.43 C33.1
CH2_CLK  (via drill 0.41 pad 0.81)
  Top 0.254: DD6.64 48.08,80.51 46.99,81.6 v46.99,83.82
  Top 0.508: v57.15,93.98 DA8.5
  Bottom 0.254: v46.99,83.82 v57.15,93.98
CH2_DAC  (via drill 0.41 pad 0.81)
  Top 0.254: R21.2 R24.1 60.01,92.39 v61.59,93.98 | DA7.6 59.7,113.35 59.37,113.03 59.37,110.81 60.01,110.17 C64.2 R103.2 v58.74,106.68
  Bottom 0.254: v61.59,93.98 67.31,93.98 70.48,97.16 70.48,104.14 67.94,106.68 v58.74,106.68
CH2_DAC0
  Top 0.254: DD6.52 53.44,74.51 54.93,73.03 54.93,71.44 55.24,71.12 R56.2
CH2_DAC1
  Top 0.254: DD6.53 53.89,75.01 55.24,73.66 R49.1
CH2_DAC2
  Top 0.254: DD6.54 53.92,75.51 54.61,76.2 R45.2
CH2_DAC3
  Top 0.254: DD6.55 53.47,76.01 54.93,77.47 55.88,77.47 56.2,77.79 R41.1
CH2_DAC4
  Top 0.254: R37.2 56.2,82.23 55.88,82.55 54.93,82.55 53.47,84.01 DD6.71
CH2_DAC5
  Top 0.254: R33.1 54.61,83.82 53.92,84.51 DD6.72
CH2_DAC6
  Top 0.254: DD6.73 53.89,85.01 55.24,86.36 R27.2
CH2_DAC7
  Top 0.254: DD6.74 53.44,85.51 54.93,87 54.93,88.58 55.24,88.9 R21.1
CH2_HPF  (via drill 0.41 pad 0.81)
  Top 0.254: DD6.75 49.63,87.09 50.16,87.63 v53.34,87.63 | VT4.1 58.1,129.22 v57.78,129.54 | v73.66,87.63 79.38,93.34 79.38,98.42 v81.28,100.33
  Bottom 0.254: v53.34,87.63 v73.66,87.63 | v81.28,100.33 81.28,125.73 77.47,129.54 v57.78,129.54
CH2_LNA
  Top 0.254: R59.2 C34.2 R54.2 R53.1 73.34,117.94 | R93.1 C58.1 | 73.34,117.94 VD8.3 76.98,117.94 77.47,118.43 C36.1 | C58.1 71.44,116.04 73.34,117.94
  Top 0.508: C58.1
EXT_CLK  (via drill 0.41 pad 0.81)
  Top 0.254: DD6.62 48.08,79.51 46.99,78.42 v46.99,76.2 | DD7.4 78.13,24.16 78.74,24.77 78.74,64.14 v69.22,73.66
  Bottom 0.254: v69.22,73.66 49.53,73.66 v46.99,76.2
MCU_MISO  (via drill 0.41 pad 0.81)
  Top 0.254: DD2.16 9.52,30.48 6.35,33.66 6.35,42.86 11.11,47.62 31.43,47.62 32.7,48.89 v33.65,48.89 | v33.65,50.8 34.92,52.07 DD4.2
  Bottom 0.254: v33.65,50.8 v33.65,48.89
MCU_MOSI
  Top 0.254: DD2.17 9.08,29.97 5.71,33.34 5.71,43.18 10.79,48.26 31.11,48.26 32.7,49.85 33.97,49.85 36.19,52.07 DD4.3
MCU_NSS
  Top 0.254: DD2.14 10.41,31.5 7.62,34.29 7.62,42.23 11.75,46.36 36.83,46.36 41.91,51.44 41.91,52.39 42.54,53.02 DD3.3
MCU_RST
  Top 0.254: DD2.13 10.86,32 8.25,34.61 8.25,41.91 12.06,45.72 37.15,45.72 42.23,50.8 R10.1
MCU_SCK
  Top 0.254: DD2.15 9.97,30.99 6.98,33.97 6.98,42.55 11.43,46.99 36.51,46.99 41.27,51.75 DD3.2
N$1
  Top 0.254: R26.1 R29.1 23.81,87.31 23.49,87.63 22.22,87.63 21.91,87.94 R23.2
N$2
  Top 0.254: R82.1 R78.2 17.46,114.3 16.52,113.35 DA5.3
N$3
  Top 0.254: DA5.2 14.6,112.7 14.29,112.4 14.29,111.76 14.6,111.44 15.87,111.44 16.19,111.13 R89.2 R90.1 C51.1
N$4
  Top 0.254: DA7.3 66.05,113.35 66.99,114.3 R93.2 R97.1
N$5
  Top 0.254: R36.1 R38.1 23.81,82.23 23.49,82.55 22.22,82.55 21.91,82.86 R34.2
N$6
  Top 0.254: R32.2 R34.1 23.81,84.78 23.49,85.09 22.22,85.09 21.91,85.41 R29.2
N$7
  Top 0.254: DA6.1 R83.2
N$8
  Top 0.254: R79.1 R76.2 21.91,107.31 22.86,106.36 VT11.3
N$9
  Top 0.254: R44.1 R46.1 23.81,77.16 23.49,77.47 22.22,77.47 21.91,77.78 R42.2
N$10
  Top 0.254: R40.2 R42.1 23.81,79.69 23.49,80.01 22.22,80.01 21.91,80.33 R38.2
N$11
  Top 0.508: R76.1 C49.2
N$12
  Top 0.254: R84.1 C51.2 R87.1
N$13
  Top 0.254: R55.1 R57.1 23.81,72.08 23.49,72.39 22.22,72.39 21.91,72.7 R51.2
N$14
  Top 0.254: R48.2 R51.1 23.81,74.61 23.49,74.93 22.22,74.93 21.91,75.25 R46.2
N$15
  Top 0.254: R84.2 R79.2 17.46,111.76 17.17,112.05 DA5.1
N$16
  Top 0.254: C55.1 R88.1 | R88.1 R89.1 | DA5.7 12.07,112.7 12.38,112.4 R88.1
N$17
  Top 0.254: R27.1 R30.1 60.01,87.31 60.32,87.63 61.59,87.63 61.91,87.94 R24.2
N$18
  Top 0.254: VT13.3 16.04,100.5 17.14,101.6 R80.2
N$19
  Top 0.254: VT13.2 14.29,103.5 13.65,104.14 R85.1
N$20
  Top 0.254: VT14.2 14.29,98.42 13.65,99.06 R86.1
N$21
  Top 0.254: R37.1 R39.1 60.01,82.23 60.32,82.55 61.59,82.55 61.91,82.86 R35.2
N$22
  Top 0.254: R33.2 R35.1 60.01,84.78 60.32,85.09 61.59,85.09 61.91,85.41 R30.2
N$23
  Top 0.254: VT11.2 21.91,102.56 20.95,101.6 R80.1 VT12.1
N$24  (via drill 0.41 pad 0.81)
  Top 0.254: VT14.3 16.68,95.42 18.1,96.84 VT12.2 18.1,98.74 | R90.2 14.29,105.73 v14.92,105.09
  Top 0.508: 18.1,98.74 v18.1,99.06 | v28.26,101.6 R83.1
  Bottom 0.254: v28.26,101.6 25.72,99.06 v18.1,99.06 14.92,102.23 v14.92,105.09
N$25
  Top 0.254: R45.1 R47.1 60.01,77.16 60.32,77.47 61.59,77.47 61.91,77.78 R43.2
N$26
  Top 0.254: R41.2 R43.1 60.01,79.69 60.32,80.01 61.59,80.01 61.91,80.33 R39.2
N$27
  Top 0.508: R86.2 C54.1 R85.2 L8.2
N$28
  Top 0.508: VT12.3 21.44,95.42 23.81,97.79 C48.1 VT11.1 23.81,106.36 25.72,108.27 L6.2
N$29
  Top 0.254: R56.1 R58.1 60.01,72.08 60.32,72.39 61.59,72.39 61.91,72.7 R52.2
N$30
  Top 0.254: R49.2 R52.1 60.01,74.61 60.32,74.93 61.59,74.93 61.91,75.25 R47.2
N$31
  Top 0.254: R81.1 R77.1 C50.1 29.21,99.06 29.53,98.74 DA6.3
N$32
  Top 0.254: DA7.2 64.13,112.7 63.82,112.4 63.82,111.76 64.13,111.44 65.41,111.44 65.72,111.13 R104.2 R105.1 C60.1
N$33
  Top 0.254: R94.1 R91.2 71.44,107.31 72.39,106.36 VT15.3
N$34
  Top 0.254: R91.1 C58.2
N$35
  Top 0.508: L7.2 C52.1 DA6.4
N$36
  Top 0.254: VT17.3 65.57,100.5 66.67,101.6 R95.2
N$37
  Top 0.254: R100.1 63.18,104.14 63.82,103.5 VT17.2
  Top 0.508: VT17.2
N$38
  Top 0.254: R101.1 63.18,99.06 63.82,98.42 VT18.2
  Top 0.508: VT18.2
N$39
  Top 0.254: VT16.1 R95.1 70.48,101.6 71.44,102.56 VT15.2
N$40  (via drill 0.41 pad 0.81)
  Top 0.254: v64.45,105.09 63.82,105.73 R105.2 | VT18.3 66.21,95.42 67.63,96.84 VT16.2 67.63,98.74 v67.63,99.06
  Top 0.508: R98.1 v54.93,101.6
  Bottom 0.254: v67.63,99.06 67.63,101.92 v64.45,105.09 60.96,101.6 v54.93,101.6
N$41
  Top 0.508: L11.2 R100.2 C63.1 R101.2
N$42
  Top 0.508: VT16.3 70.97,95.42 73.34,97.79 C57.1 VT15.1 73.34,106.36 75.25,108.27 L9.2
N$43
  Top 0.508: DA8.4 C61.1 L10.2
N$44
  Top 0.254: R96.1 R92.1 C59.1 55.88,99.06 56.2,98.74 DA8.3
N$45
  Top 0.254: R99.1 C60.2 R102.1
N$46
  Top 0.254: R99.2 R94.2 66.67,111.76 66.38,112.05 DA7.1
N$47
  Top 0.254: DA8.1 R98.2
N$48
  Top 0.254: DA7.7 61.6,112.7 61.91,112.4 C64.1 | C64.1 R104.1 | R103.1 C64.1
N$49
  Top 0.254: 64.13,126.22 64.13,127.63 63.82,127.95 C35.1 63.82,130.81 64.45,131.44 66.67,131.44 67.31,132.08 XS6.1
  Top 0.508: K2.7 64.13,126.22
N$50
  Top 0.254: 14.6,126.22 14.6,127.63 14.29,127.95 C32.1 14.29,130.81 14.92,131.44 15.87,131.44 16.51,132.08 XS5.1
  Top 0.508: K1.7 14.6,126.22
N$51
  Top 0.254: C32.2 R22.1 18.1,128.59 19.04,127.65 K1.5
N$52
  Top 0.254: R22.2 R31.1 C31.1 R28.1 20.95,124.46 20.32,123.83 17.14,123.83 16.84,124.13 K1.6
N$53
  Top 0.254: R50.1 C35.2
  Top 0.508: K2.5 68.57,127.65 67.63,128.59 R50.1
N$54
  Top 0.254: VT5.2 44.77,109.54 | 44.77,109.54 R60.2 | VT6.2 48.58,108.9 47.94,109.54 44.77,109.54
N$55
  Top 0.254: VD6.1 8.57,124.15 7.62,125.09 VT3.3 10.01,125.9 10.3,126.19 K1.8
N$56
  Top 0.254: VD9.1 58.1,124.15 57.15,125.09 VT4.3 59.54,125.9 59.83,126.19 K2.8
N$57
  Top 0.254: XS7.1 67.31,12.7 69.85,15.24 R71.1 R70.1
N$58
  Top 0.254: VT7.2 R66.1
N$59
  Top 0.254: VT8.2 29.53,109.54 | 29.53,109.54 R67.2 | VT9.2 33.34,108.9 32.7,109.54 29.53,109.54
N$60
  Top 0.254: C41.1 R65.1 R64.2 55.24,114.3 55.88,113.66 55.88,110.49 54.29,108.9 VT7.1
N$61
  Top 0.254: VT6.1 R61.2 C38.1 R64.1
N$62
  Top 0.254: R50.2 R59.1 C34.1 R54.1 70.48,124.46 69.85,123.83 66.67,123.83 66.37,124.13 K2.6
N$63
  Top 0.254: VT5.1 46.67,107 47.31,106.36 47.31,104.78 46.67,104.14 R62.2 R63.2
N$64
  Top 0.254: R17.2 42.86,135.57 43.18,135.89 VD5.A
N$65
  Top 0.254: C37.1 L4.1 R60.1 R61.1
N$66
  Top 0.254: 73.34,20.01 R70.2 | 73.34,20.01 72.39,20.95 VD10.3 | DD7.2 76.2,20.64 75.56,20 73.34,20 73.34,20.01
N$67
  Top 0.254: VT10.2 R75.1
N$68
  Top 0.254: C46.1 R74.1 R73.2 40,114.3 40.64,113.66 40.64,110.49 39.05,108.9 VT10.1
N$69
  Top 0.254: R73.1 C44.1 R68.2 VT9.1
N$70  (via drill 0.41 pad 0.81)
  Top 0.254: VT8.1 31.43,107 32.38,106.05 32.38,104.78 v31.75,104.14
  Top 0.508: v35.88,99.06 R69.2 R72.2
  Bottom 0.254: v31.75,104.14 31.75,100.33 33.02,99.06 v35.88,99.06
N$71
  Top 0.508: C14.1
  Top 1.016: C14.1 35.24,11.43 34.04,12.64 L1.2 T1.3
  Bottom 1.016: T1.3 38.73,15.24 41.27,17.78 T1.2
N$72
  Top 0.254: C42.1 L5.1 R67.1 R68.1
N$73
  Top 0.254: XS1.2 15.26,11.13 18.1,13.97 DD1.4
N$74
  Top 0.254: XS1.3 16.51,8.41 16.51,11.43 20,14.92 DD1.6
N$75
  Bottom 1.016: XS1.1 22.59,9.16 FU1.2
N$76
  Top 0.254: R10.2 46.67,52.71 46.35,53.02 U1.1
N$77  (via drill 0.41 pad 0.81)
  Top 1.016: v35.56,19.69 v35.56,20.95 VT2.5,6
  Bottom 1.016: T1.4 40,13.34 36.83,13.34 35.56,14.61 v35.56,19.69 v35.56,20.95
N$78
  Top 0.254: DA2.3 R13.1 R11.2
N$79
  Top 0.508: DA1.4 27.62,20 27.94,20.32 C10.1
N$80
  Top 1.016: VT2.7,8 T1.1
N$81
  Top 0.254: VT2.4 34.23,28 33.65,28.58 33.65,29.84 33.34,30.16 DD5.4
N$82
  Top 0.254: DD5.6 35.24,30.16 35.56,29.84 37.15,29.84 37.46,29.53 VT2.2
N$83
  Top 0.508: VD4.A VD2.C 50.16,15.24
  Top 1.016: 50.16,15.24 T1.8
N$84  (via drill 0.41 pad 0.81)
  Top 0.508: v50.16,20.32 VD3.A VD1.C
  Top 1.016: v50.16,20.32 v48.89,20.32
  Bottom 1.016: T1.5 48.26,20.32 v48.89,20.32 v50.16,20.32
N$85
  Top 0.508: VD4.C 56.52,12.7 56.83,13.02 56.83,13.97 | 56.83,20.32 VD3.C
  Top 1.016: 56.83,13.97 56.83,20.32 57.47,20.95 60.96,20.95 61.21,21.21 L3.1
N$86
  Top 0.508: VD2.A 53.66,15.24 53.34,15.56 53.34,16.51 | 53.34,17.78 VD1.A
  Top 1.016: 53.34,16.51 53.34,17.78 53.34,20.95 53.59,21.21 L2.1
N$87
  Top 0.254: VT1.1 55.1,36.66 56.2,35.56 DA2.4
N$88
  Top 0.508: DA3.1 60.01,27.94 60.32,27.62 60.96,27.62 | DA4.3 69.53,27.94 69.22,27.62 68.58,27.62 | DA4.1 67.63,27.62 | DA3.3 61.91,27.62
  Top 1.016: C18.1 65.72,27.62 | 68.58,27.62 67.63,27.62 65.72,27.62 | 65.72,27.62 64.45,27.62 | 64.45,27.62 61.91,27.62 60.96,27.62 | 64.45,27.62 64.52,27.56 L3.2
N$89
  Top 0.254: DA3.4 61.91,32.7 62.23,33.02 C20.1
N$90
  Top 0.254: DA4.4 69.53,32.7 69.85,33.02 C22.1
N$91
  Top 0.508: VT1.3 53.34,33.34 53.97,32.7 54.93,32.7 | DA2.2 57.15,32.7
  Top 1.016: 54.93,32.7 57.15,32.7 58.1,31.75 C15.1 58.1,28.89 56.9,27.69 L2.2
PLD_LED
  Top 0.254: DD6.88 41.91,95.57 42.54,96.2 42.54,100.01 40.64,101.92 40.64,105.41 41.91,106.68 41.91,132.08 40.96,133.03 R17.1
PLD_MISO  (via drill 0.41 pad 0.81)
  Top 0.254: DD6.41 43.41,70.72 42.54,69.85 42.54,66.99 41.27,65.72 40.64,65.09 v40,65.09 | DD4.7 34.92,61.28 38.1,64.45 v38.1,65.09
  Bottom 0.254: v40,65.09 v38.1,65.09
PLD_MOSI
  Top 0.254: DD6.40 42.91,71.17 41.91,70.17 41.91,67.31 40.64,66.04 39.37,66.04 39.05,65.72 39.05,64.45 36.19,61.59 DD4.6
PLD_NSS
  Top 0.254: DD6.43 44.41,69.81 43.81,69.22 43.81,62.87 42.54,61.59 DD3.6
PLD_RST
  Top 0.254: DD6.44 44.91,69.36 44.45,68.9 44.45,67.31 44.77,66.99 R9.2 44.77,65.09 44.45,64.77 44.45,62.87 46.35,60.96 U1.4
PLD_SCK
  Top 0.254: DD6.42 43.91,70.26 43.18,69.53 43.18,63.18 41.27,61.28 DD3.7
PWM_PP1  (via drill 0.41 pad 0.81)
  Top 0.254: DD5.1 35.24,35.24 v35.56,35.56 R12.1 | DD2.43 22.8,29.46 26.35,33.02 30.8,33.02 v31.43,32.38
  Bottom 0.254: v35.56,35.56 34.61,35.56 v31.43,32.38
PWM_PP2
  Top 0.254: DD5.3 33.34,35.24 33.02,35.56 R14.1 31.43,34.29 30.8,33.66 26.03,33.66 23.37,30.99 DD2.46
REF_CLK  (via drill 0.41 pad 0.81)
  Top 0.254: DD6.14 35.74,79.51 36.83,78.42 v36.83,76.2 | ZQ2.3 14.77,81.11 v15.24,80.64
  Bottom 0.254: v15.24,80.64 19.68,76.2 v36.83,76.2
STOP_TAC_FB
  Top 0.254: VT10.3 VT9.3 C45.1 40,101.6 41.91,99.69 41.91,96.52 41.27,95.89 41.27,89.22 40.91,88.85 DD6.90
STOP_TAC_OUT
  Top 0.254: DD6.91 40.41,89.31 40.64,89.53 40.64,95.89 40,96.52 R72.1
STRT_TAC_FB
  Top 0.254: VT7.3 VT6.3 C40.1 49.53,99.38 45.72,95.57 43.81,95.57 43.18,94.93 43.18,89.53 43.41,89.31 DD6.85
STRT_TAC_OUT
  Top 0.254: DD6.86 42.91,88.85 42.54,89.22 42.54,95.25 43.18,95.89 43.18,98.42 43.81,99.06 R63.1
SUP_2V5  (via drill 0.41 pad 0.81)
  Top 0.254: C1.1 R7.1 R5.2 v20.64,12.7 | DD2.19 8.95,28.96 v7.94,27.94
  Bottom 0.254: v20.64,12.7 6.98,12.7 5.08,14.61 5.08,25.08 v7.94,27.94
SUP_+3V3A  (via drill 0.41 pad 0.81)
  Top 0.254: DD6.94 38.91,88.72 v38.42,89.22 | DD6.31 38.41,71.43 v37.78,70.8 | DD6.80 45.91,88.71 v45.4,89.22 | v46.67,69.53 45.41,70.8 DD6.45 | DD6.13 33.34,80.01 32.7,79.38 v32.7,78.74 | DD6.9 33.24,82.01 v32.7,82.55 | DD6.59 50.58,78.01 v51.12,77.47 | DD6.63 v51.12,80.01
  Top 0.508: v37.78,70.8 37.15,70.17 C27.1 R15.2 C12.1 35.24,62.55 34.29,61.59 v33.65,61.59 DD4.8 | C26.1 37.15,90.48 v38.42,89.22 | C25.1 44.77,89.85 v45.4,89.22 | v46.67,69.53 47.62,68.58 C29.1 48.58,67 47.62,66.04 R9.1 | v32.7,78.74 C28.1 | C24.1 31.43,82.23 31.75,82.55 v32.7,82.55 | C30.1 54.29,80.33 53.97,80.01 v51.12,80.01 | C23.1 54.29,77.78 53.97,77.47 v51.12,77.47 | v24.45,93.98 R81.2 L7.1 | L10.1 R96.2 v51.12,93.98 | R18.2 R16.2 v20.64,68.58 | R69.1 v40.32,99.06 | v43.5,101.6 R62.1 | ZQ2.4 9.63,82.02 10.48,82.87 C39.1 v8.89,83.82 | v40,61.59 DD3.8 | 75.25,25.72 C43.1 75.25,29.52 75.25,36.51 74.29,37.47 67.63,37.47 | 75.25,25.72 DD7.5 | VD10.2 71.44,24.77 72.39,25.72 75.25,25.72 | DA4.5 67.63,33.02
  Top 1.016: 67.63,33.02 C21.1 67.63,37.47 67.63,48.58 v66.36,49.85 v65.41,50.8
  Bottom 0.508: v33.65,61.59 v40,61.59
  Bottom 1.016: v46.67,69.53 v65.41,50.8 v66.36,49.85
  pour Bottom (isolate 0.254, rank 5): 31.75,85.09 32.38,85.72 32.38,88.27 27.3,93.34 24.13,93.34 23.81,93.66 23.81,94.3 24.13,94.62 27.3,94.62 34.29,87.63 34.29,83.19 35.56,81.92 38.73,81.92 39.37,82.55 39.37,87 37.46,88.9 37.46,90.17 38.73,91.44 38.73,99.69 41.91,102.87 43.81,102.87 44.45,102.23 44.45,97.16 46.99,94.62 51.43,94.62 52.07,93.98 52.07,93.34 44.45,85.72 44.45,82.55 45.08,81.92 51.43,81.92 52.07,81.28 52.07,76.84 51.43,76.2 50.8,76.2 48.89,78.11 45.08,78.11 44.45,77.47 44.45,74.3 48.89,69.22 48.89,67.31 46.99,67.31 45.72,68.58 29.21,68.58 27.3,70.48 23.49,70.48 20.95,67.94 20.32,67.94 19.68,68.58 19.68,69.22 22.86,72.39 38.73,72.39 39.37,73.03 39.37,77.47 38.73,78.11 32.38,78.11 27.94,82.55 8.25,82.55 7.62,83.19 7.62,84.45 8.25,85.09
SUP_+3V3B  (via drill 0.41 pad 0.81)
  Top 0.254: DD2.9 15.87,34.92 15.56,35.24 | DD2.1 19.94,34.86 20.32,35.24 | DD2.36 19.94,23.56 20.32,23.18 | DD2.24 12.71,26.05 12.38,25.72 12.38,25.08 | DD2.48 22.48,32 v22.86,32.38
  Top 0.508: 15.56,35.24 15.24,35.56 v13.65,35.56 C2.1 | 20.32,35.24 v20.64,35.56 C4.1 | 20.32,23.18 v20.64,22.86 C5.1 | 12.38,25.08 v12.38,24.45 C3.1 | 25.72,20.32 DA1.5 | 25.72,20.32 26.67,21.27 XS3.1 30.48,22.86 31.43,23.81 R4.2 R6.2 | C9.1 25.72,20.32 | R3.2 R1.2 R2.2 6.67,22.86 v7.94,24.13 | DD4.1 v33.65,52.7 33.65,52.07 32.38,50.8 C11.1 31.43,49.53 30.8,48.89 22.22,48.89 v21.59,49.53 | DD3.1 v40,52.7 | C16.1 34.61,33.02 34.29,32.7 DD5.5 v34.29,30.48
  Bottom 0.508: v40,52.7 v33.65,52.7
  pour Bottom (isolate 0.254, rank 5): 20.32,43.18 12.06,34.92 12.06,29.21 7.3,24.45 7.3,23.81 7.62,23.49 10.79,23.49 13.97,20.32 27.94,20.32 35.56,27.94 35.56,31.12 34.92,31.75 33.65,31.75 27.3,25.4 19.68,25.4 18.41,26.67 18.41,30.48 19.05,31.12 22.86,31.12 23.49,31.75 23.49,33.02 22.86,33.66 22.86,49.53 22.22,50.16 20.95,50.16 20.32,49.53
SUP_+5V0A  (via drill 0.41 pad 0.81)
  Top 0.254: DA5.8 11.07,111.4 v10.79,111.12 | DA7.8 60.6,111.4 v60.32,111.12 | 60.01,40.64 R13.2
  Top 0.508: VD6.3 9.67,120.82 10.3,120.19 K1.1 11.43,118.75 10.48,117.8 C47.1 v9.21,116.84 | VD9.3 59.2,120.82 59.83,120.19 K2.1 60.96,118.75 60.01,117.8 C56.1 v58.74,116.84 | L6.1 27.62,113.34 | 27.62,113.34 v27.62,114.3 L5.2 | 27.62,113.34 VD7.2 | L9.1 77.15,113.34 v77.15,114.3 77.15,113.35 VD8.2 | v43.5,114.3 L4.2 | DA2.5 58.1,35.24 58.42,35.56 C19.1 | DA3.5 60.01,33.02
  Top 1.016: C19.1 60.01,40.64 61.59,42.23 61.59,60.33 66.04,64.77 66.04,83.82 76.83,94.62 76.83,100.33 v78.1,101.6 v78.1,102.87 v78.1,104.14 | C19.1 60.01,33.02 | C19.1
  Bottom 0.508: v27.62,114.3
  pour Bottom (isolate 0.254, rank 4): 10.79,110.49 5.71,110.49 5.71,118.11 7.62,120.02 27.3,120.02 32.38,114.94 55.24,114.94 60.32,120.02 75.56,120.02 79.38,116.2 79.38,101.6 78.74,100.97 77.47,100.97 77.47,110.49 76.2,111.76 76.2,114.94 74.93,116.2 64.77,116.2 63.5,114.94 63.5,111.76 62.23,110.49 31.11,110.49 24.76,116.84 12.7,116.84 11.43,115.57 11.43,111.12
SUP_+5V0B  (via drill 0.41 pad 0.81)
  Top 0.508: v25.72,15.24 DA1.1 | C8.1 v25.72,15.24 | DA1.3 27.62,15.55 27.3,15.24 v25.72,15.24 | C8.1 25.72,11.11 FU1.1 | v19.05,15.24 DD1.5 | C8.1 R5.1
  Top 1.016: FU1.1 C13.1 29.53,11.43 30.73,12.64 L1.1
  Bottom 0.508: v25.72,15.24 v19.05,15.24
SUP_-2V5A  (via drill 0.41 pad 0.81)
  Top 0.254: DA5.4 15.6,114.66 v15.87,114.94 | DA7.4 65.13,114.66 v65.41,114.94
  Top 0.508: C53.1 16.19,115.25 v15.87,114.94 | C62.1 65.72,115.25 v65.41,114.94 | VD7.1 25.72,114.62 v25.72,114.3 | L8.1 v6.67,106.68 | VD8.1 v75.25,114.3 | L11.1 v56.2,106.68 | VT1.2 52.39,38.1
  Top 1.016: R11.1 52.39,38.1 | R11.1 | C17.1 52.39,44.77 60.32,52.7 60.32,60.96 64.77,65.41 64.77,84.45 75.56,95.25 v75.56,101.6 v75.56,102.87 v75.56,104.14 | C17.1 R11.1 | C17.1
  pour Bottom (isolate 0.254, rank 5): 5.71,116.84 5.71,106.05 6.35,105.41 6.98,105.41 7.62,106.05 7.62,107.31 8.89,108.59 50.8,108.59 53.97,105.41 57.47,105.41 58.74,106.68 67.94,106.68 70.48,104.14 70.48,100.97 77.47,100.97 77.47,110.49 76.2,111.76 76.2,114.94 74.93,116.2 64.77,116.2 63.5,114.94 63.5,111.76 62.23,110.49 31.11,110.49 24.76,116.84
SYS_BT0  (via drill 0.41 pad 0.81)
  Top 0.254: DD2.44 17.27,29.97 v16.51,29.21 | R8.1 11.43,12.7 XS2.1
  Bottom 0.254: v16.51,29.21 16.51,17.78 XS2.1
SYS_HS0
  Top 0.254: DD2.5 17.91,36 18.1,36.2 C6.1 | C6.1 | C6.1 18.1,39.05 17.14,40.01 17.14,42.55 17.61,43.01 ZQ1.1
SYS_HS1
  Top 0.254: DD2.6 17.4,35.94 16.19,37.15 C7.1 16.19,39.05 15.34,39.9 ZQ1.3
SYS_RST  (via drill 0.41 pad 0.81)
  Top 0.254: XS2.4 R1.1 | DD2.7 16.89,32.13 v15.24,30.48
  Bottom 0.254: v15.24,30.48 15.24,29.21 15.87,28.58 15.87,19.69 15.24,19.05 12.7,19.05 XS2.4
SYS_RXD  (via drill 0.41 pad 0.81)
  Top 0.254: XS2.3 15.24,17.78 17.4,19.94 DD2.31 | R2.1 v8.57,21.91
  Bottom 0.254: v8.57,21.91 8.57,17.46 9.52,16.51 12.7,16.51 XS2.3
SYS_SWC
  Top 0.254: R6.1 XS3.3 25.4,27.94 23.88,26.42 DD2.37
SYS_SWD  (via drill 0.41 pad 0.81)
  Top 0.254: R4.1 XS3.2 | DD2.34 18.92,26.16 v18.41,26.67
  Bottom 0.254: v18.41,26.67 19.68,25.4 XS3.2
SYS_TCK
  Top 0.254: DD6.24 32.92,74.51 32.38,73.98 32.38,66.67 30.48,64.77 28.26,64.77 26.99,63.5 XS4.2 R19.1
SYS_TDI
  Top 0.254: DD6.23 32.46,75.01 31.75,74.3 31.75,67.31 30.48,66.04 XS4.3 28.57,66.04 27.3,64.77 26.03,64.77 24.76,66.04 R18.1
SYS_TDO
  Top 0.254: XS4.1 30.48,63.5 33.02,66.04 33.02,67.31 33.34,67.63 R15.1 33.34,69.53 33.02,69.85 33.02,73.66 33.37,74.01 DD6.25
SYS_TMS
  Top 0.254: DD6.22 32.01,75.51 31.11,74.61 31.11,67.94 30.48,67.31 27.94,67.31 XS4.4 25.4,67.31 24.13,67.31 23.81,67.63 R16.1
SYS_TXD
  Top 0.254: R3.1 XS2.2 12.7,16.51 12.7,18.41 13.33,19.05 15.56,19.05 16.89,20.38 DD2.30
USB_D+
  Top 0.254: DD1.1 20,20.01 18.41,21.59 DD2.33
USB_D-
  Top 0.254: DD2.32 17.91,20.19 18.1,20 DD1.3